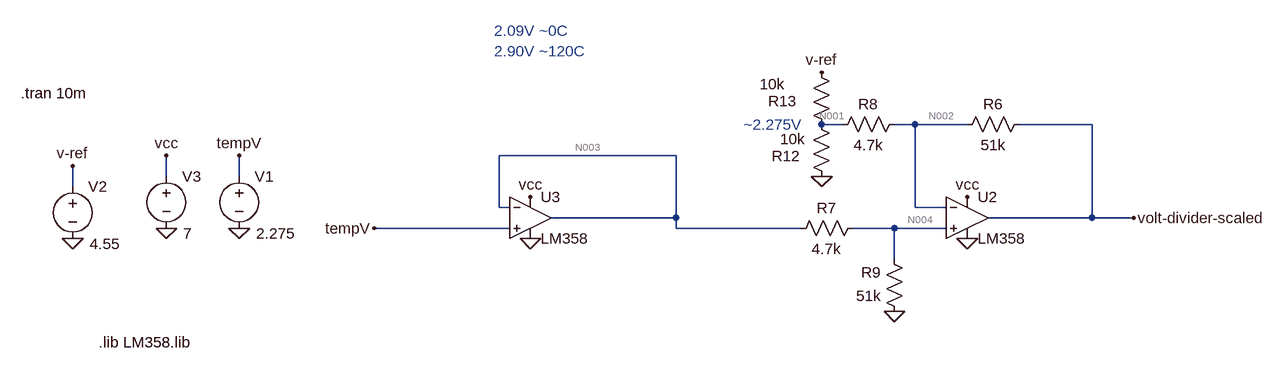
[diagram p0: schematic temp-measurement-temp.asc]
temp-measurement-temp.asc, the LTspice schematic file:
Version 4
SHEET 1 2988 984
WIRE 1168 496 1136 496
WIRE 1280 496 1248 496
WIRE 1360 496 1280 496
WIRE 1552 496 1440 496
WIRE 912 544 640 544
WIRE 128 576 128 544
WIRE 240 576 240 544
WIRE -16 592 -16 560
WIRE 640 624 640 544
WIRE 656 624 640 624
WIRE 1280 624 1280 496
WIRE 1328 624 1280 624
WIRE 912 640 912 544
WIRE 912 640 720 640
WIRE 1552 640 1552 496
WIRE 1552 640 1392 640
WIRE 1616 640 1552 640
WIRE 656 656 448 656
WIRE 912 656 912 640
WIRE 1104 656 912 656
WIRE 1248 656 1184 656
WIRE 1328 656 1248 656
WIRE 1248 704 1248 656
FLAG -16 672 0
FLAG -16 560 v-ref
FLAG 1360 672 0
FLAG 1360 608 vcc
FLAG 1616 640 volt-divider-scaled
FLAG 1248 784 0
FLAG 240 656 0
FLAG 240 544 tempV
FLAG 128 656 0
FLAG 128 544 vcc
FLAG 688 672 0
FLAG 688 608 vcc
FLAG 1136 576 0
FLAG 1136 416 v-ref
FLAG 448 656 tempV
SYMBOL voltage -16 576 R0
WINDOW 3 26 104 Left 2
WINDOW 123 0 0 Left 0
WINDOW 39 0 0 Left 0
SYMATTR Value 4.55
SYMATTR InstName V2
SYMBOL OpAmps\\opamp2 1360 576 R0
SYMATTR InstName U2
SYMATTR Value LM358
SYMBOL res 1456 480 R90
WINDOW 0 0 56 VBottom 2
WINDOW 3 32 56 VTop 2
SYMATTR InstName R6
SYMATTR Value 51k
SYMBOL res 1200 640 R90
WINDOW 0 0 56 VBottom 2
WINDOW 3 32 56 VTop 2
SYMATTR InstName R7
SYMATTR Value 4.7k
SYMBOL res 1264 480 R90
WINDOW 0 0 56 VBottom 2
WINDOW 3 32 56 VTop 2
SYMATTR InstName R8
SYMATTR Value 4.7k
SYMBOL res 1264 800 R180
WINDOW 0 36 76 Left 2
WINDOW 3 36 40 Left 2
SYMATTR InstName R9
SYMATTR Value 51k
SYMBOL voltage 240 560 R0
WINDOW 3 26 104 Left 2
WINDOW 123 0 0 Left 0
WINDOW 39 0 0 Left 0
SYMATTR Value 2.275
SYMATTR InstName V1
SYMBOL voltage 128 560 R0
WINDOW 3 26 104 Left 2
WINDOW 123 0 0 Left 0
WINDOW 39 0 0 Left 0
SYMATTR Value 7
SYMATTR InstName V3
SYMBOL OpAmps\\opamp2 688 576 R0
SYMATTR InstName U3
SYMATTR Value LM358
SYMBOL res 1120 480 R0
WINDOW 0 -61 65 Left 2
WINDOW 3 -48 39 Left 2
SYMATTR InstName R12
SYMATTR Value 10k
SYMBOL res 1120 400 R0
WINDOW 0 -66 60 Left 2
WINDOW 3 -79 34 Left 2
SYMATTR InstName R13
SYMATTR Value 10k
TEXT -96 448 Left 2 !.tran 10m
TEXT 24 832 Left 2 !.lib LM358.lib
TEXT 1016 496 Left 2 ;~2.275V
TEXT 632 352 Left 2 ;2.09V ~0C\n2.90V ~120C

The netlist it stands for:
* temp-measurement-temp.asc
V2 v-ref 0 4.55
XU2 N004 N002 vcc 0 volt-divider-scaled LM358  ; pins In+ In- V+ V- OUT
R6 volt-divider-scaled N002 51k
R7 N004 N003 4.7k
R8 N002 N001 4.7k
R9 0 N004 51k
V1 tempV 0 2.275
V3 vcc 0 7
XU3 tempV N003 vcc 0 N003 LM358  ; pins In+ In- V+ V- OUT
R12 N001 0 10k
R13 v-ref N001 10k
.tran 10m
.lib LM358.lib
* ~2.275V
* 2.09V ~0C
* 2.90V ~120C
.backanno
.end

* Results of the author's LTspice run, read from the files saved beside the schematic
* Operating Point, zero values left out:
*   V(v-ref) = 4.55 V
*   V(volt-divider-scaled) = 1.077 V
*   V(vcc) = 7 V
*   V(n002) = 2.084 V
*   V(n004) = 2.083 V
*   V(n003) = 2.275 V
*   V(n001) = 2.176 V
*   V(tempv) = 2.275 V
*   I(R6) = -19.75 µA
*   I(R7) = -40.84 µA
*   I(R8) = -19.74 µA
*   I(R9) = -40.85 µA
*   I(R12) = 217.6 µA
*   I(R13) = 237.4 µA
*   I(V2) = -237.4 µA
*   I(V1) = 10 nA
*   I(V3) = -640.8 µA
*   Ix(u2:IN+) = -10 nA
*   Ix(u2:IN-) = -9.502 nA
*   Ix(u2:VCC) = 300 µA
*   Ix(u2:VEE) = -319.7 µA
*   Ix(u2:OUT) = 19.75 µA
*   Ix(u3:IN+) = -10 nA
*   Ix(u3:IN-) = -9.502 nA
*   Ix(u3:VCC) = 340.8 µA
*   Ix(u3:VEE) = -300 µA
*   Ix(u3:OUT) = -40.83 µA